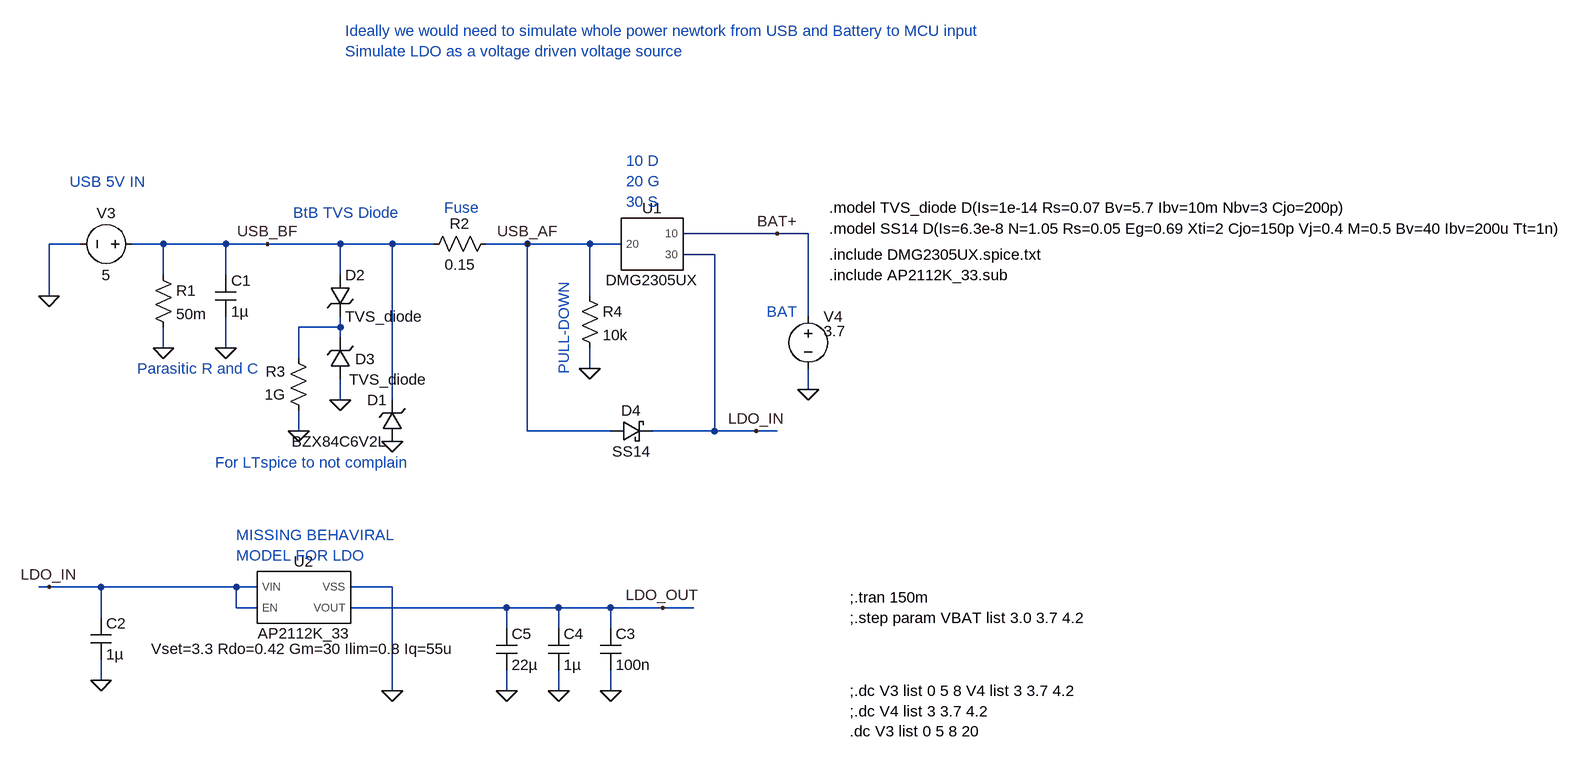
[diagram p0: schematic power-delivery.asc]
power-delivery.asc, the LTspice schematic file:
Version 4
SHEET 1 2392 1704
WIRE 1152 848 1008 848
WIRE 1200 848 1152 848
WIRE 80 864 32 864
WIRE 208 864 160 864
WIRE 304 864 208 864
WIRE 368 864 304 864
WIRE 480 864 368 864
WIRE 560 864 480 864
WIRE 624 864 560 864
WIRE 768 864 704 864
WIRE 864 864 768 864
WIRE 912 864 864 864
WIRE 1056 880 1008 880
WIRE 208 912 208 864
WIRE 304 912 304 864
WIRE 480 912 480 864
WIRE 32 944 32 864
WIRE 864 944 864 864
WIRE 1200 976 1200 848
WIRE 480 992 480 976
WIRE 480 992 416 992
WIRE 480 1008 480 992
WIRE 208 1024 208 992
WIRE 304 1024 304 976
WIRE 416 1040 416 992
WIRE 864 1056 864 1024
WIRE 1200 1088 1200 1056
WIRE 480 1104 480 1072
WIRE 560 1104 560 864
WIRE 416 1152 416 1120
WIRE 768 1152 768 864
WIRE 896 1152 768 1152
WIRE 1056 1152 1056 880
WIRE 1056 1152 960 1152
WIRE 1120 1152 1056 1152
WIRE 1152 1152 1120 1152
WIRE 32 1392 16 1392
WIRE 112 1392 32 1392
WIRE 320 1392 112 1392
WIRE 352 1392 320 1392
WIRE 560 1392 496 1392
WIRE 320 1424 320 1392
WIRE 352 1424 320 1424
WIRE 736 1424 496 1424
WIRE 816 1424 736 1424
WIRE 896 1424 816 1424
WIRE 976 1424 896 1424
WIRE 1024 1424 976 1424
WIRE 112 1440 112 1392
WIRE 736 1456 736 1424
WIRE 816 1456 816 1424
WIRE 896 1456 896 1424
WIRE 112 1536 112 1504
WIRE 560 1552 560 1392
WIRE 736 1552 736 1520
WIRE 816 1552 816 1520
WIRE 896 1552 896 1520
FLAG 32 944 0
FLAG 208 1024 0
FLAG 304 1024 0
FLAG 416 1152 0
FLAG 480 1104 0
FLAG 1200 1088 0
FLAG 864 1056 0
FLAG 1152 848 BAT+
FLAG 768 864 USB_AF
FLAG 368 864 USB_BF
FLAG 1120 1152 LDO_IN
FLAG 32 1392 LDO_IN
FLAG 112 1536 0
FLAG 976 1424 LDO_OUT
FLAG 736 1552 0
FLAG 816 1552 0
FLAG 896 1552 0
FLAG 560 1552 0
FLAG 560 1168 0
SYMBOL Voltage 176 864 R90
WINDOW 0 -32 56 VBottom 2
WINDOW 3 32 56 VTop 2
SYMATTR InstName V3
SYMATTR Value 5
SYMBOL Cap 288 912 R0
SYMATTR InstName C1
SYMATTR Value 1µ
SYMBOL Res 192 896 R0
SYMATTR InstName R1
SYMATTR Value 50m
SYMBOL Res 720 848 R90
WINDOW 0 0 56 VBottom 2
WINDOW 3 32 56 VTop 2
SYMATTR InstName R2
SYMATTR Value 0.15
SYMBOL zener 464 912 R0
SYMATTR InstName D2
SYMATTR Value TVS_diode
SYMBOL zener 496 1072 R180
WINDOW 0 -38 31 Left 2
WINDOW 3 -117 -1 Left 2
SYMATTR InstName D3
SYMATTR Value TVS_diode
SYMBOL Res 432 1136 R180
WINDOW 0 36 76 Left 2
WINDOW 3 36 40 Left 2
SYMATTR InstName R3
SYMATTR Value 1G
SYMBOL Voltage 1200 960 R0
WINDOW 3 24 38 Left 2
SYMATTR InstName V4
SYMATTR Value 3.7
SYMATTR SpiceLine Rser=25m
SYMBOL AutoGenerated/DMG2305UX 960 864 R0
SYMATTR InstName U1
SYMBOL Res 848 928 R0
SYMATTR InstName R4
SYMATTR Value 10k
SYMBOL schottky 896 1168 R270
WINDOW 0 32 32 VTop 2
WINDOW 3 0 32 VBottom 2
SYMATTR InstName D4
SYMATTR Value SS14
SYMBOL Cap 96 1440 R0
SYMATTR InstName C2
SYMATTR Value 1µ
SYMATTR SpiceLine Rser=10m
SYMBOL Cap 880 1456 R0
SYMATTR InstName C3
SYMATTR Value 100n
SYMATTR SpiceLine Rser=15m
SYMBOL Cap 800 1456 R0
SYMATTR InstName C4
SYMATTR Value 1µ
SYMATTR SpiceLine Rser=10m
SYMBOL Cap 720 1456 R0
SYMATTR InstName C5
SYMATTR Value 22µ
SYMATTR SpiceLine Rser=5m
SYMBOL AutoGenerated/AP2112K_33 416 1408 R0
SYMATTR InstName U2
SYMBOL zener 576 1168 R180
WINDOW 0 24 64 Left 2
WINDOW 3 24 0 Left 2
SYMATTR InstName D1
SYMATTR Value BZX84C6V2L
TEXT 488 536 Left 2 ;Ideally we would need to simulate whole power newtork from USB and Battery to MCU input\nSimulate LDO as a voltage driven voltage source
TEXT 64 768 Left 2 ;USB 5V IN
TEXT 168 1056 Left 2 ;Parasitic R and C
TEXT 1232 808 Left 2 !.model TVS_diode D(Is=1e-14 Rs=0.07 Bv=5.7 Ibv=10m Nbv=3 Cjo=200p)
TEXT 288 1200 Left 2 ;For LTspice to not complain
TEXT 408 816 Left 2 ;BtB TVS Diode
TEXT 640 808 Left 2 ;Fuse
TEXT 1232 880 Left 2 !.include DMG2305UX.spice.txt
TEXT 920 736 Left 2 ;10 D\n20 G\n30 S
TEXT 1136 968 Left 2 ;BAT
TEXT 824 920 VRight 2 ;PULL-DOWN
TEXT 1232 840 Left 2 !.model SS14 D(Is=6.3e-8 N=1.05 Rs=0.05 Eg=0.69 Xti=2 Cjo=150p Vj=0.4 M=0.5 Bv=40 Ibv=200u Tt=1n)
TEXT 320 1312 Left 2 ;MISSING BEHAVIRAL \nMODEL FOR LDO
TEXT 1232 912 Left 2 !.include AP2112K_33.sub
TEXT 1264 1408 Left 2 !;.tran 150m\n;.step param VBAT list 3.0 3.7 4.2
TEXT 1264 1552 Left 2 !;.dc V3 list 0 5 8 V4 list 3 3.7 4.2\n;.dc V4 list 3 3.7 4.2\n.dc V3 list 0 5 8 20

The netlist it stands for:
* power-delivery.asc
V3 USB_BF 0 5
C1 USB_BF 0 1µ
R1 USB_BF 0 50m
R2 USB_AF USB_BF 0.15
D2 USB_BF N001 TVS_diode
D3 0 N001 TVS_diode
R3 0 N001 1G
V4 BAT+ 0 3.7 Rser=25m
XU1 BAT+ USB_AF LDO_IN DMG2305UX  ; pins 10 20 30
R4 USB_AF 0 10k
D4 USB_AF LDO_IN SS14
C2 LDO_IN 0 1µ Rser=10m
C3 LDO_OUT 0 100n Rser=15m
C4 LDO_OUT 0 1µ Rser=10m
C5 LDO_OUT 0 22µ Rser=5m
XU2 LDO_IN LDO_IN 0 LDO_OUT AP2112K_33 Vset=3.3 Rdo=0.42 Gm=30 Ilim=0.8 Iq=55u  ; pins VIN EN VSS VOUT
D1 0 USB_BF BZX84C6V2L
.model D D
.lib standard.dio
* Ideally we would need to simulate whole power newtork from USB and Battery to MCU input
* Simulate LDO as a voltage driven voltage source
* USB 5V IN
* Parasitic R and C
.model TVS_diode D(Is=1e-14 Rs=0.07 Bv=5.7 Ibv=10m Nbv=3 Cjo=200p)
* For LTspice to not complain
* BtB TVS Diode
* Fuse
.include DMG2305UX.spice.txt
* 10 D
* 20 G
* 30 S
* BAT
* PULL-DOWN
.model SS14 D(Is=6.3e-8 N=1.05 Rs=0.05 Eg=0.69 Xti=2 Cjo=150p Vj=0.4 M=0.5 Bv=40 Ibv=200u Tt=1n)
* MISSING BEHAVIRAL
* MODEL FOR LDO
.include AP2112K_33.sub
;.tran 150m
;.step param VBAT list 3.0 3.7 4.2
;.dc V3 list 0 5 8 V4 list 3 3.7 4.2
;.dc V4 list 3 3.7 4.2
.dc V3 list 0 5 8 20
.lib /Users/alex/Library/CloudStorage/OneDrive-Personal/Uni/aether-node/hardware/DMG2305UX.spice.txt
.lib /Users/alex/Library/CloudStorage/OneDrive-Personal/Uni/aether-node/hardware/AP2112K_33.sub
.backanno
.end